# EAGLE schematic PIRT1280A1-12-carrier (EAGLE 9.6.2)

## Sheet 1 of 2: Power Supply
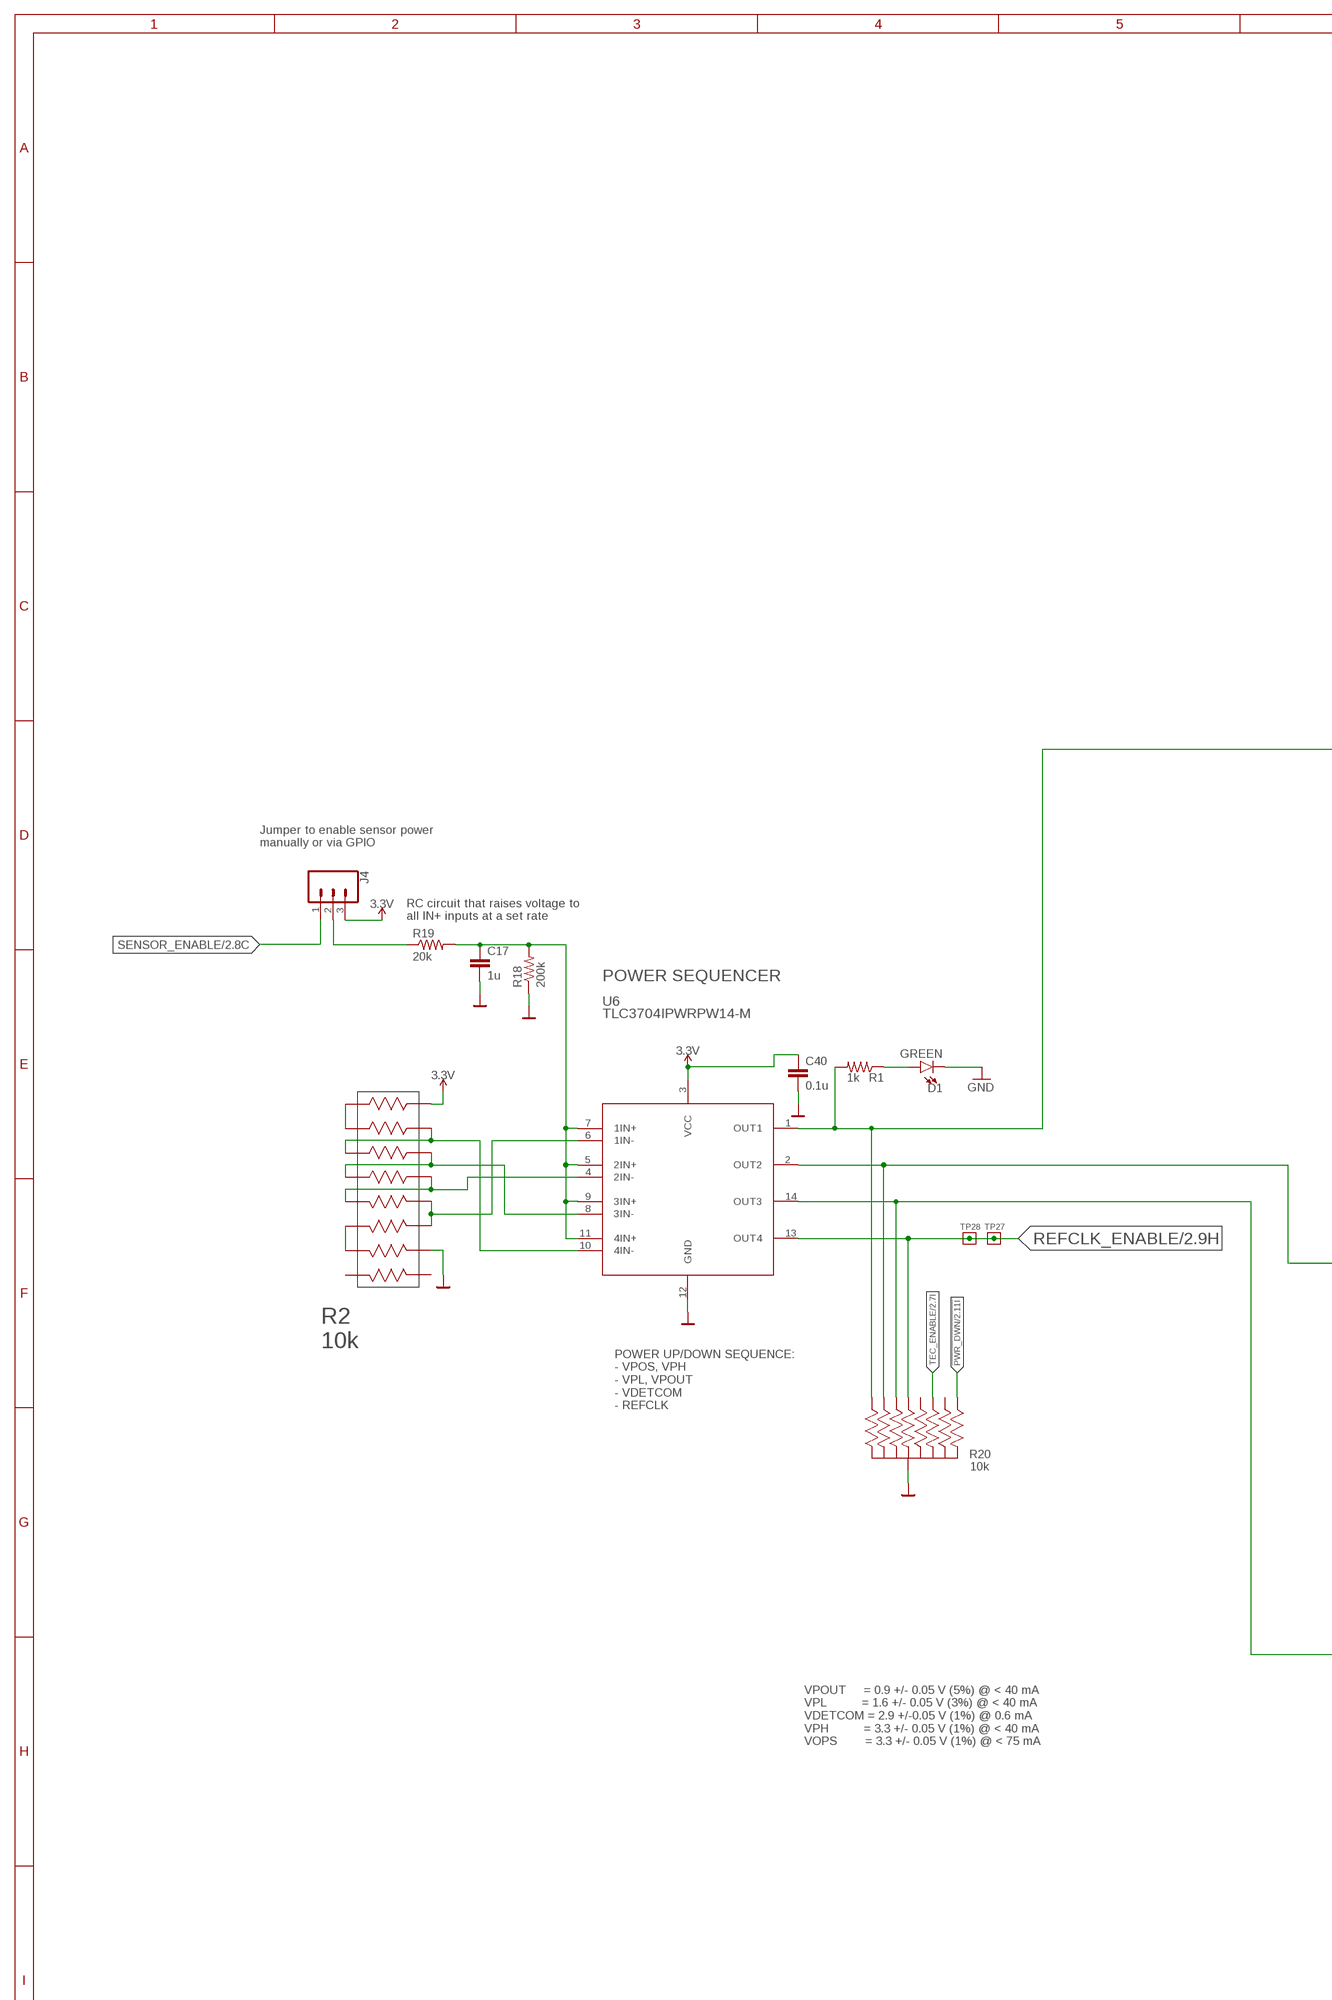
[diagram p0: schematic, sheet 1, part 1 of 2]
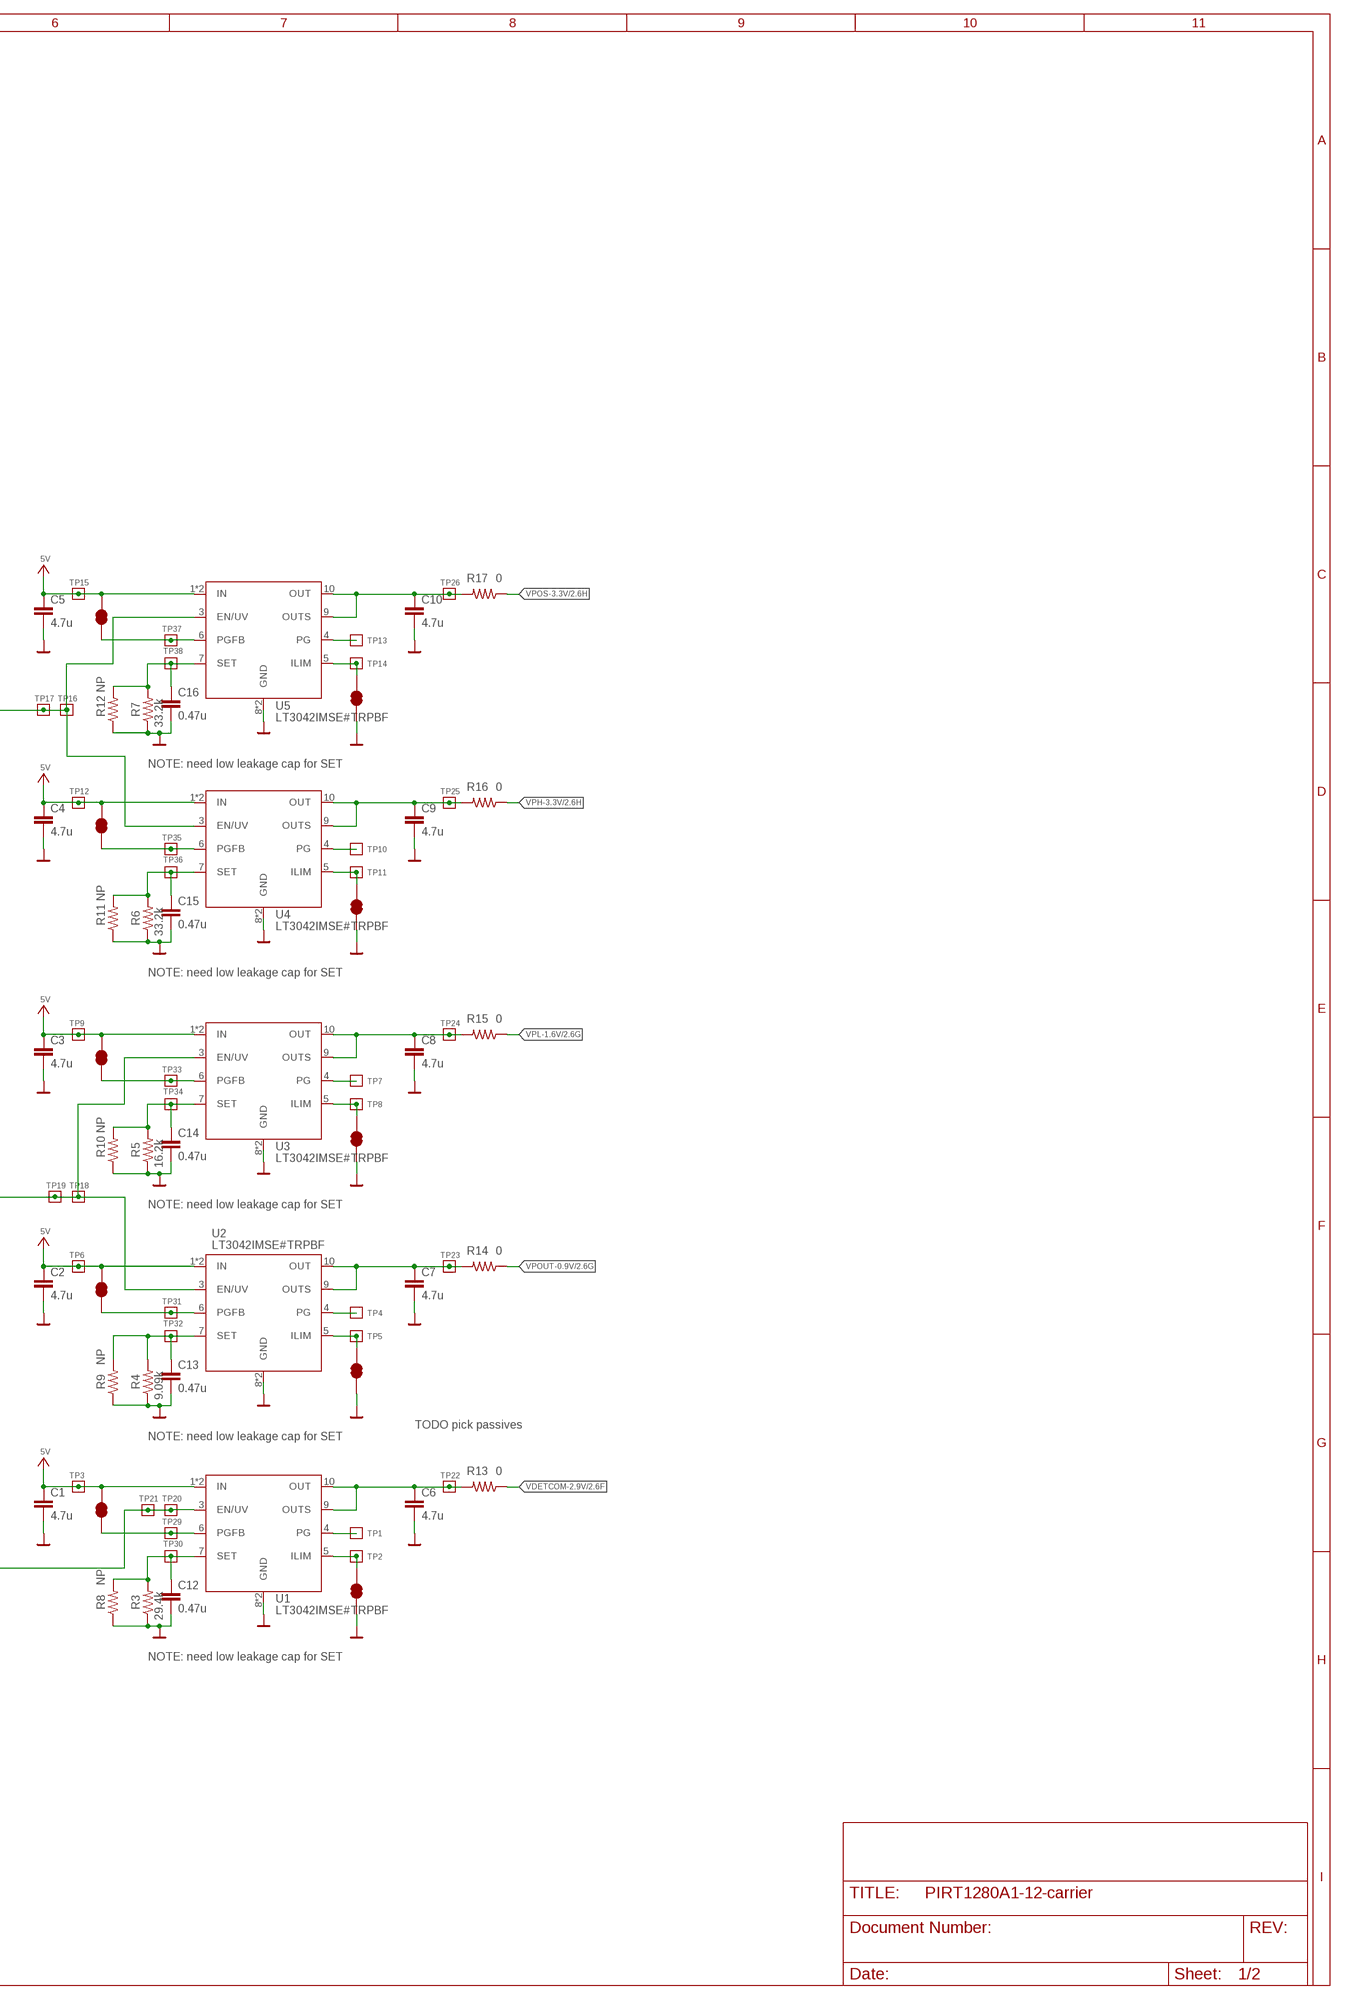
[diagram p1: schematic, sheet 1, part 2 of 2]

### Parts
C1  4.7u  C-EU0603-A  [.0603-A]
C2  4.7u  C-EU0603-A  [.0603-A]
C3  4.7u  C-EU0603-A  [.0603-A]
C4  4.7u  C-EU0603-A  [.0603-A]
C5  4.7u  C-EU0603-A  [.0603-A]
C6  4.7u  C-EU0603-A  [.0603-A]
C7  4.7u  C-EU0603-A  [.0603-A]
C8  4.7u  C-EU0603-A  [.0603-A]
C9  4.7u  C-EU0603-A  [.0603-A]
C10  4.7u  C-EU0603-A  [.0603-A]
C12  0.47u  C-EU0603-A  [.0603-A]
C13  0.47u  C-EU0603-A  [.0603-A]
C14  0.47u  C-EU0603-A  [.0603-A]
C15  0.47u  C-EU0603-A  [.0603-A]
C16  0.47u  C-EU0603-A  [.0603-A]
C17  1u  C-EU0603-A  [.0603-A]
C40  0.1u  C-EU0603-A  [.0603-A]
D1  GREEN  LED-GREEN0603  [LED-0603]
J4  455-1750-1-ND  CONN_03  [1X03]
R1  1k  R-US_0603-A  [.0603-A]
R2  10k  EXB-2HV103JV  [RES_EXB2HV]
R3  29.4k  R-US_0603-A  [.0603-A]
R4  9.09k  R-US_0603-A  [.0603-A]
R5  16.2k  R-US_0603-A  [.0603-A]
R6  33.2k  R-US_0603-A  [.0603-A]
R7  33.2k  R-US_0603-A  [.0603-A]
R8  NP  R-US_0603-A  [.0603-A]
R9  NP  R-US_0603-A  [.0603-A]
R10  NP  R-US_0603-A  [.0603-A]
R11  NP  R-US_0603-A  [.0603-A]
R12  NP  R-US_0603-A  [.0603-A]
R13  0  R-US_0603-A  [.0603-A]
R14  0  R-US_0603-A  [.0603-A]
R15  0  R-US_0603-A  [.0603-A]
R16  0  R-US_0603-A  [.0603-A]
R17  0  R-US_0603-A  [.0603-A]
R18  200k  R-US_0805-A  [.0805-A]
R19  20k  R-US_0805-A  [.0805-A]
R20  10k  EXB-A10P391JC_ARRAY_EXBA-M  [ARRAY_EXBA-M]
SJ1  JUMPER-SMT_2_NC_TRACE_NO-SILK  [SMT-JUMPER_2_NC_TRACE_NO-SILK]
SJ2  JUMPER-SMT_2_NC_TRACE_NO-SILK  [SMT-JUMPER_2_NC_TRACE_NO-SILK]
SJ3  JUMPER-SMT_2_NC_TRACE_NO-SILK  [SMT-JUMPER_2_NC_TRACE_NO-SILK]
SJ4  JUMPER-SMT_2_NC_TRACE_NO-SILK  [SMT-JUMPER_2_NC_TRACE_NO-SILK]
SJ5  JUMPER-SMT_2_NC_TRACE_NO-SILK  [SMT-JUMPER_2_NC_TRACE_NO-SILK]
SJ6  JUMPER-SMT_2_NC_TRACE_NO-SILK  [SMT-JUMPER_2_NC_TRACE_NO-SILK]
SJ7  JUMPER-SMT_2_NC_TRACE_NO-SILK  [SMT-JUMPER_2_NC_TRACE_NO-SILK]
SJ8  JUMPER-SMT_2_NC_TRACE_NO-SILK  [SMT-JUMPER_2_NC_TRACE_NO-SILK]
SJ9  JUMPER-SMT_2_NC_TRACE_NO-SILK  [SMT-JUMPER_2_NC_TRACE_NO-SILK]
SJ10  JUMPER-SMT_2_NC_TRACE_NO-SILK  [SMT-JUMPER_2_NC_TRACE_NO-SILK]
TP1  TEST-POINT-LARGE-SQUARE  [1X01]
TP2  TEST-POINT-LARGE-SQUARE  [1X01]
TP3  TEST-POINT-LARGE-SQUARE  [1X01]
TP4  TEST-POINT-LARGE-SQUARE  [1X01]
TP5  TEST-POINT-LARGE-SQUARE  [1X01]
TP6  TEST-POINT-LARGE-SQUARE  [1X01]
TP7  TEST-POINT-LARGE-SQUARE  [1X01]
TP8  TEST-POINT-LARGE-SQUARE  [1X01]
TP9  TEST-POINT-LARGE-SQUARE  [1X01]
TP10  TEST-POINT-LARGE-SQUARE  [1X01]
TP11  TEST-POINT-LARGE-SQUARE  [1X01]
TP12  TEST-POINT-LARGE-SQUARE  [1X01]
TP13  TEST-POINT-LARGE-SQUARE  [1X01]
TP14  TEST-POINT-LARGE-SQUARE  [1X01]
TP15  TEST-POINT-LARGE-SQUARE  [1X01]
TP16  TEST-POINT-LARGE-SQUARE  [1X01]
TP17  TEST-POINT-LARGE-SQUARE  [1X01]
TP18  TEST-POINT-LARGE-SQUARE  [1X01]
TP19  TEST-POINT-LARGE-SQUARE  [1X01]
TP20  TEST-POINT-LARGE-SQUARE  [1X01]
TP21  TEST-POINT-LARGE-SQUARE  [1X01]
TP22  TEST-POINT-LARGE-SQUARE  [1X01]
TP23  TEST-POINT-LARGE-SQUARE  [1X01]
TP24  TEST-POINT-LARGE-SQUARE  [1X01]
TP25  TEST-POINT-LARGE-SQUARE  [1X01]
TP26  TEST-POINT-LARGE-SQUARE  [1X01]
TP27  TEST-POINT-LARGE-SQUARE  [1X01]
TP28  TEST-POINT-LARGE-SQUARE  [1X01]
TP29  TEST-POINT-LARGE-SQUARE  [1X01]
TP30  TEST-POINT-LARGE-SQUARE  [1X01]
TP31  TEST-POINT-LARGE-SQUARE  [1X01]
TP32  TEST-POINT-LARGE-SQUARE  [1X01]
TP33  TEST-POINT-LARGE-SQUARE  [1X01]
TP34  TEST-POINT-LARGE-SQUARE  [1X01]
TP35  TEST-POINT-LARGE-SQUARE  [1X01]
TP36  TEST-POINT-LARGE-SQUARE  [1X01]
TP37  TEST-POINT-LARGE-SQUARE  [1X01]
TP38  TEST-POINT-LARGE-SQUARE  [1X01]
U1  LT3042IMSE#TRPBF  [SOP50P490X110-11N]
U2  LT3042IMSE#TRPBF  [SOP50P490X110-11N]
U3  LT3042IMSE#TRPBF  [SOP50P490X110-11N]
U4  LT3042IMSE#TRPBF  [SOP50P490X110-11N]
U5  LT3042IMSE#TRPBF  [SOP50P490X110-11N]
U6  TLC3704IPWRPW14-M  [14-TSSOP]

### Nets
3.3V: C40.1 J4.3 R2.16 U6.3(VCC) ; also sheet 2
5V: C1.1 C2.1 C3.1 C4.1 C5.1 SJ6.2 SJ7.2 SJ8.2 SJ9.2 SJ10.2 TP3.1 TP6.1 TP9.1 TP12.1 TP15.1 U1.1(IN) U1.2(IN) U2.1(IN) U2.2(IN) U3.1(IN) U3.2(IN) U4.1(IN) U4.2(IN) U5.1(IN) U5.2(IN) ; also sheet 2
!PWR_DWN: R20.1 ; also sheet 2
GND: C1.2 C2.2 C3.2 C4.2 C5.2 C6.2 C7.2 C8.2 C9.2 C10.2 C12.2 C13.2 C14.2 C15.2 C16.2 C17.2 C40.2 D1.C R2.10 R3.1 R4.1 R5.1 R6.1 R7.1 R8.1 R9.1 R10.1 R11.1 R12.1 R18.1 R20.5 R20.10 SJ1.1 SJ2.1 SJ3.1 SJ4.1 SJ5.1 U1.8(GND) U1.11(GND) U2.8(GND) U2.11(GND) U3.8(GND) U3.11(GND) U4.8(GND) U4.11(GND) U5.8(GND) U5.11(GND) U6.12(GND) ; also sheet 2
N$1: R2.1 R2.2
N$2: R2.3 R2.15 U6.10(4IN-)
N$3: R2.4 R2.14 U6.8(3IN-)
N$4: R2.5 R2.13 U6.4(2IN-)
N$5: C17.1 R18.2 R19.2 U6.5(2IN+) U6.7(1IN+) U6.9(3IN+) U6.11(4IN+)
N$6: R2.6 R2.7
N$10: R20.7 TP20.1 TP21.1 U1.3(EN/UV) U6.14(OUT3)
N$11: SJ7.1 TP31.1 U2.6(PGFB)
N$12: SJ2.2 TP4.1 U2.5(ILIM)
N$15: TP5.1 U2.4(PG)
N$17: J4.2 R19.1
N$20: C13.1 R4.2 R9.2 TP32.1 U2.7(SET)
N$21: SJ1.2 TP1.1 U1.5(ILIM)
N$22: SJ6.1 TP29.1 U1.6(PGFB)
N$23: TP2.1 U1.4(PG)
N$24: C12.1 R3.2 R8.2 TP30.1 U1.7(SET)
N$25: R1.2 R20.6 TP16.1 TP17.1 U4.3(EN/UV) U5.3(EN/UV) U6.1(OUT1)
N$26: SJ5.2 TP13.1 U5.5(ILIM)
N$27: SJ10.1 TP37.1 U5.6(PGFB)
N$28: TP14.1 U5.4(PG)
N$29: C16.1 R7.2 R12.2 TP38.1 U5.7(SET)
N$31: SJ4.2 TP10.1 U4.5(ILIM)
N$32: SJ9.1 TP35.1 U4.6(PGFB)
N$33: TP11.1 U4.4(PG)
N$35: C15.1 R6.2 R11.2 TP36.1 U4.7(SET)
N$36: R20.4 TP18.1 TP19.1 U2.3(EN/UV) U3.3(EN/UV) U6.2(OUT2)
N$37: SJ3.2 TP7.1 U3.5(ILIM)
N$38: SJ8.1 TP33.1 U3.6(PGFB)
N$39: TP8.1 U3.4(PG)
N$40: C14.1 R5.2 R10.2 TP34.1 U3.7(SET)
N$44: R2.11 R2.12 U6.6(1IN-)
N$270: D1.A R1.1
REFCLK_ENABLE: R20.3 TP27.1 TP28.1 U6.13(OUT4) ; also sheet 2
SENSOR_ENABLE: J4.1 ; also sheet 2
TEC_ENABLE: R20.2 ; also sheet 2
VDETCOM: C6.1 R13.2 TP22.1 U1.9(OUTS) U1.10(OUT)
VDETCOM-2.9V: R13.1 ; also sheet 2
VPH: C9.1 R16.2 TP25.1 U4.9(OUTS) U4.10(OUT)
VPH-3.3V: R16.1 ; also sheet 2
VPL: C8.1 R15.2 TP24.1 U3.9(OUTS) U3.10(OUT)
VPL-1.6V: R15.1 ; also sheet 2
VPOS: C10.1 R17.2 TP26.1 U5.9(OUTS) U5.10(OUT)
VPOS-3.3V: R17.1 ; also sheet 2
VPOUT: C7.1 R14.2 TP23.1 U2.9(OUTS) U2.10(OUT)
VPOUT-0.9V: R14.1 ; also sheet 2
Unconnected: R2.8 R2.9 R20.8 R20.9

### Notes on the sheet
- NOTE: need low leakage cap for SET
- Jumper to enable sensor power 
  manually or via GPIO
- RC circuit that raises voltage to 
  all IN+ inputs at a set rate
- POWER SEQUENCER
- NOTE: need low leakage cap for SET
- NOTE: need low leakage cap for SET
- POWER UP/DOWN SEQUENCE:
  - VPOS, VPH
  - VPL, VPOUT
  - VDETCOM
  - REFCLK
- TODO pick passives
- NOTE: need low leakage cap for SET
- NOTE: need low leakage cap for SET
- VPOUT     = 0.9 +/- 0.05 V (5%) @ < 40 mA
  VPL          = 1.6 +/- 0.05 V (3%) @ < 40 mA 
  VDETCOM = 2.9 +/-0.05 V (1%) @ 0.6 mA
  VPH          = 3.3 +/- 0.05 V (1%) @ < 40 mA
  VOPS        = 3.3 +/- 0.05 V (1%) @ < 75 mA

## Sheet 2 of 2: PocketBeagle, Serdes, Connectors
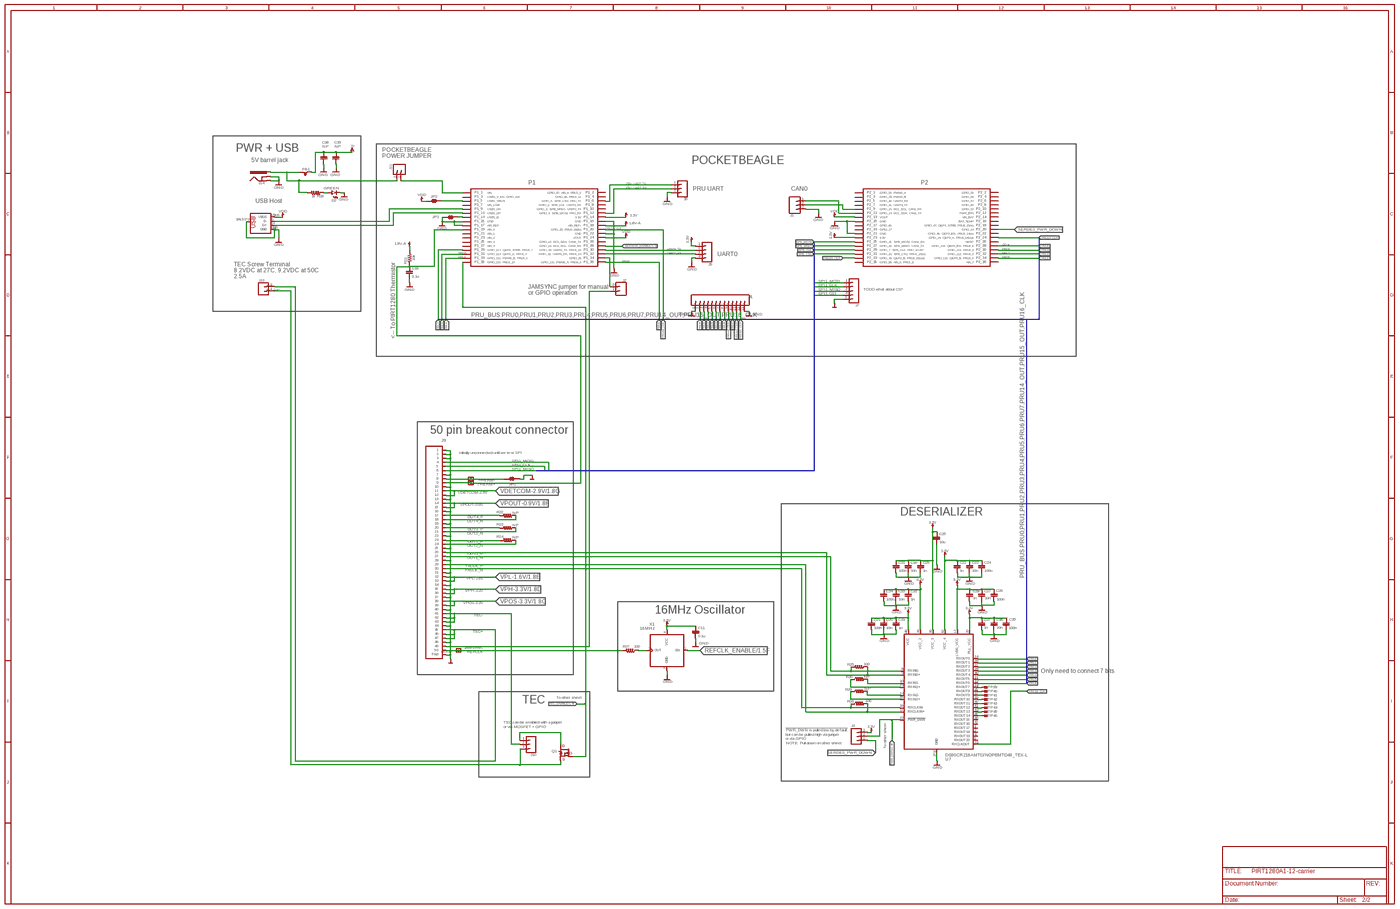
[diagram p2: schematic, sheet 2, overview]
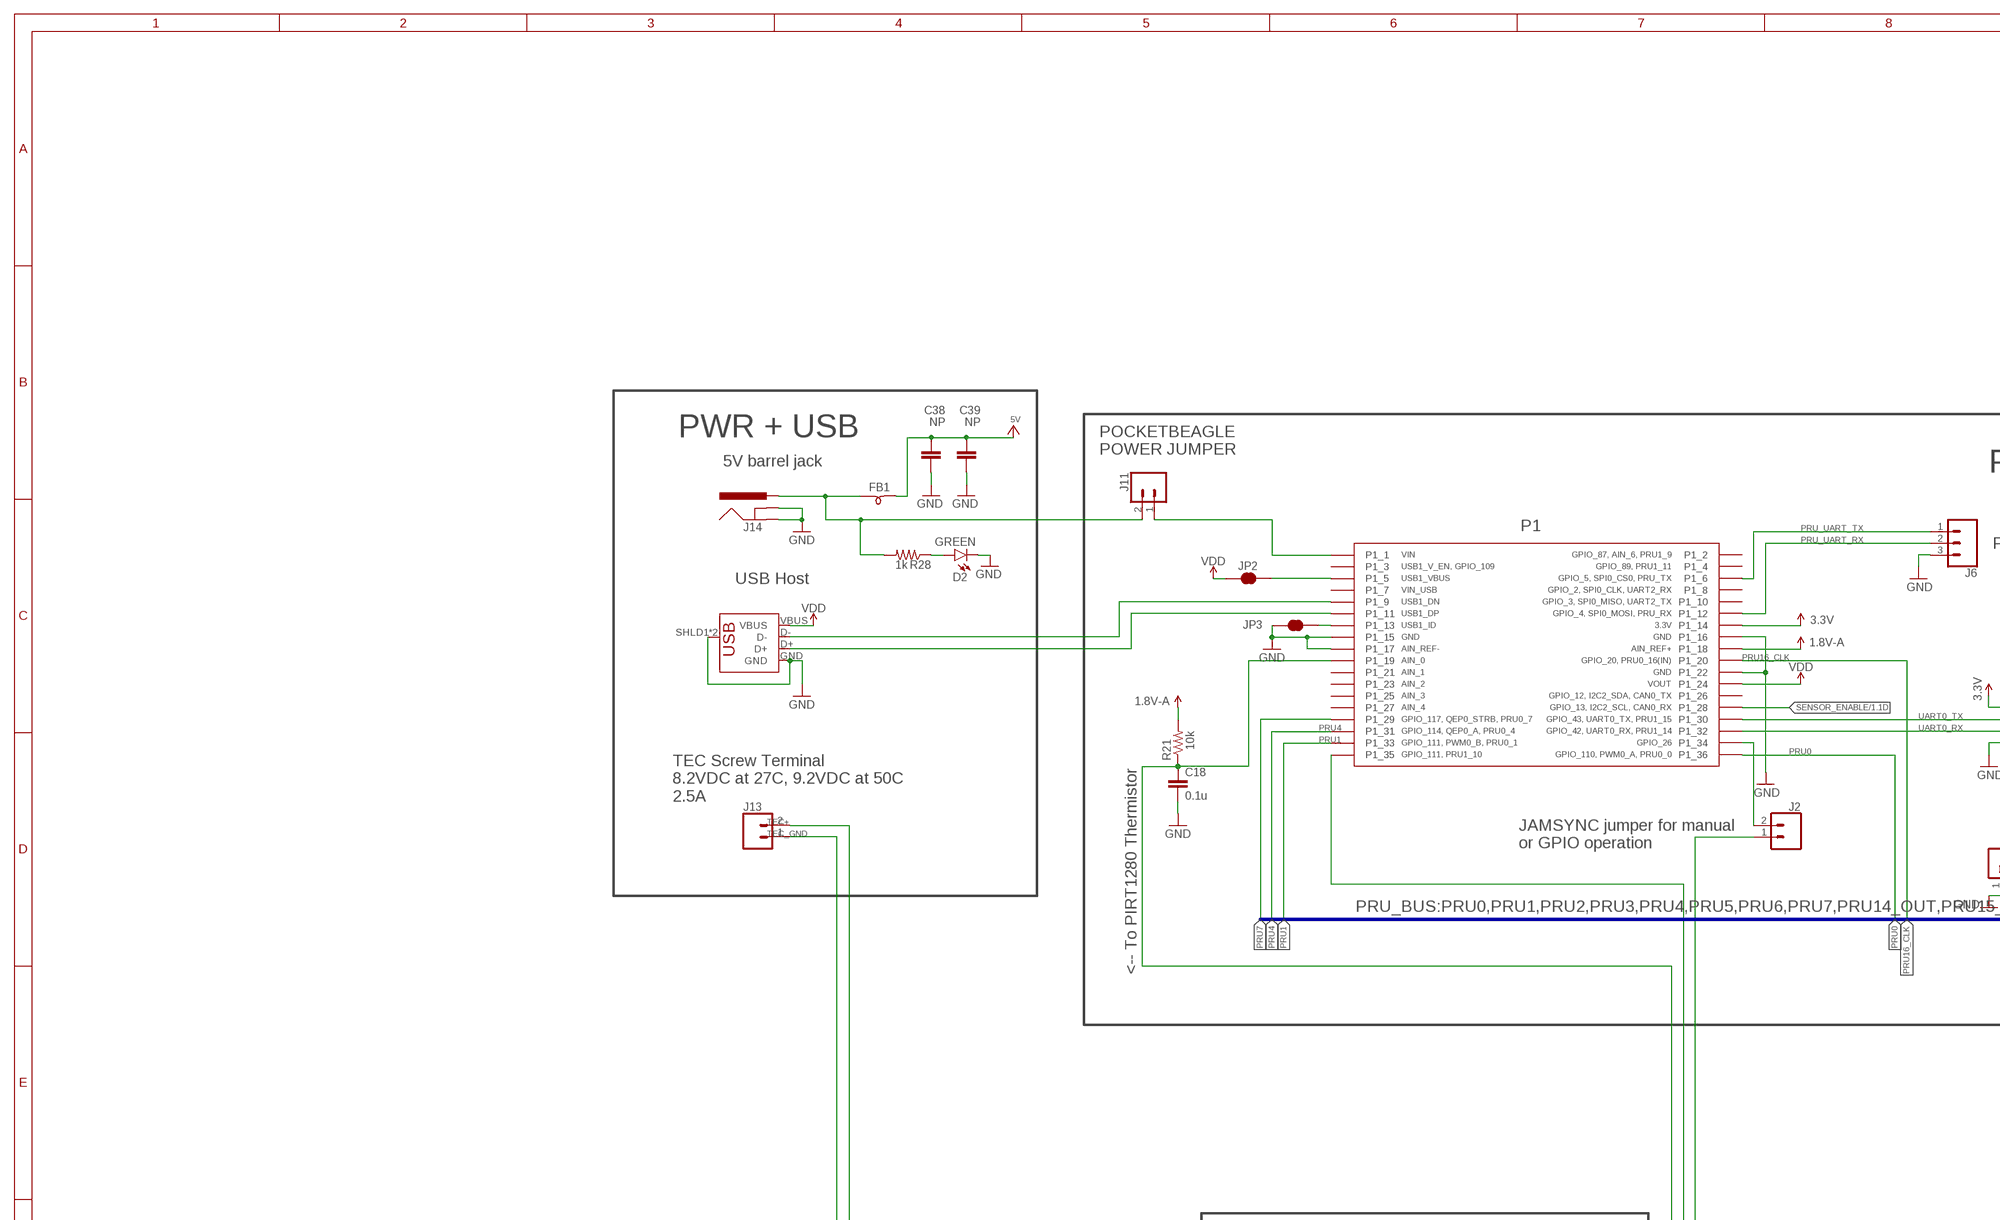
[diagram p3: schematic, sheet 2, part 1 of 4]
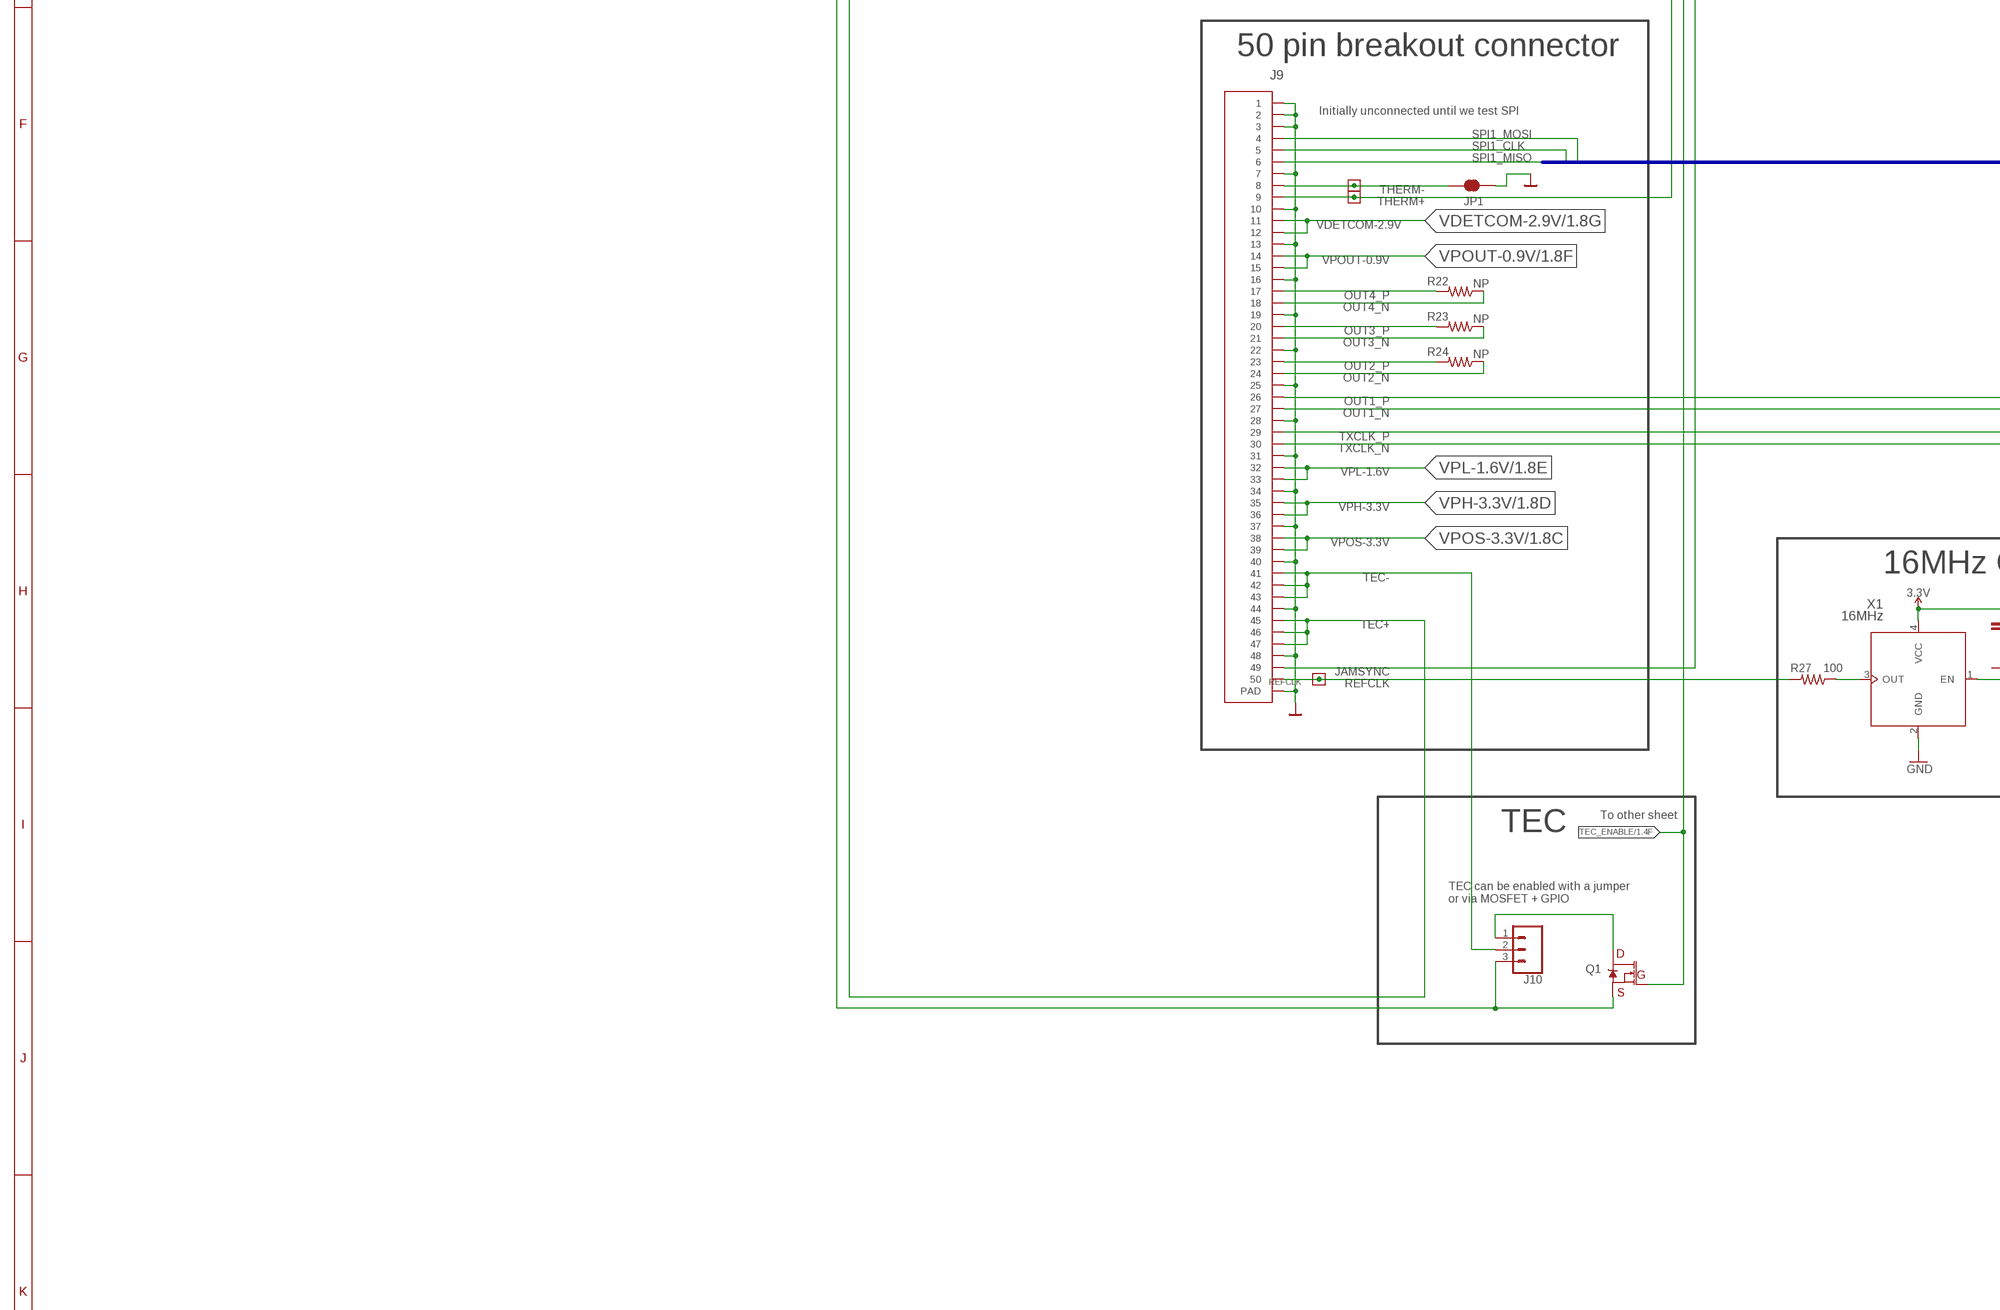
[diagram p4: schematic, sheet 2, part 2 of 4]
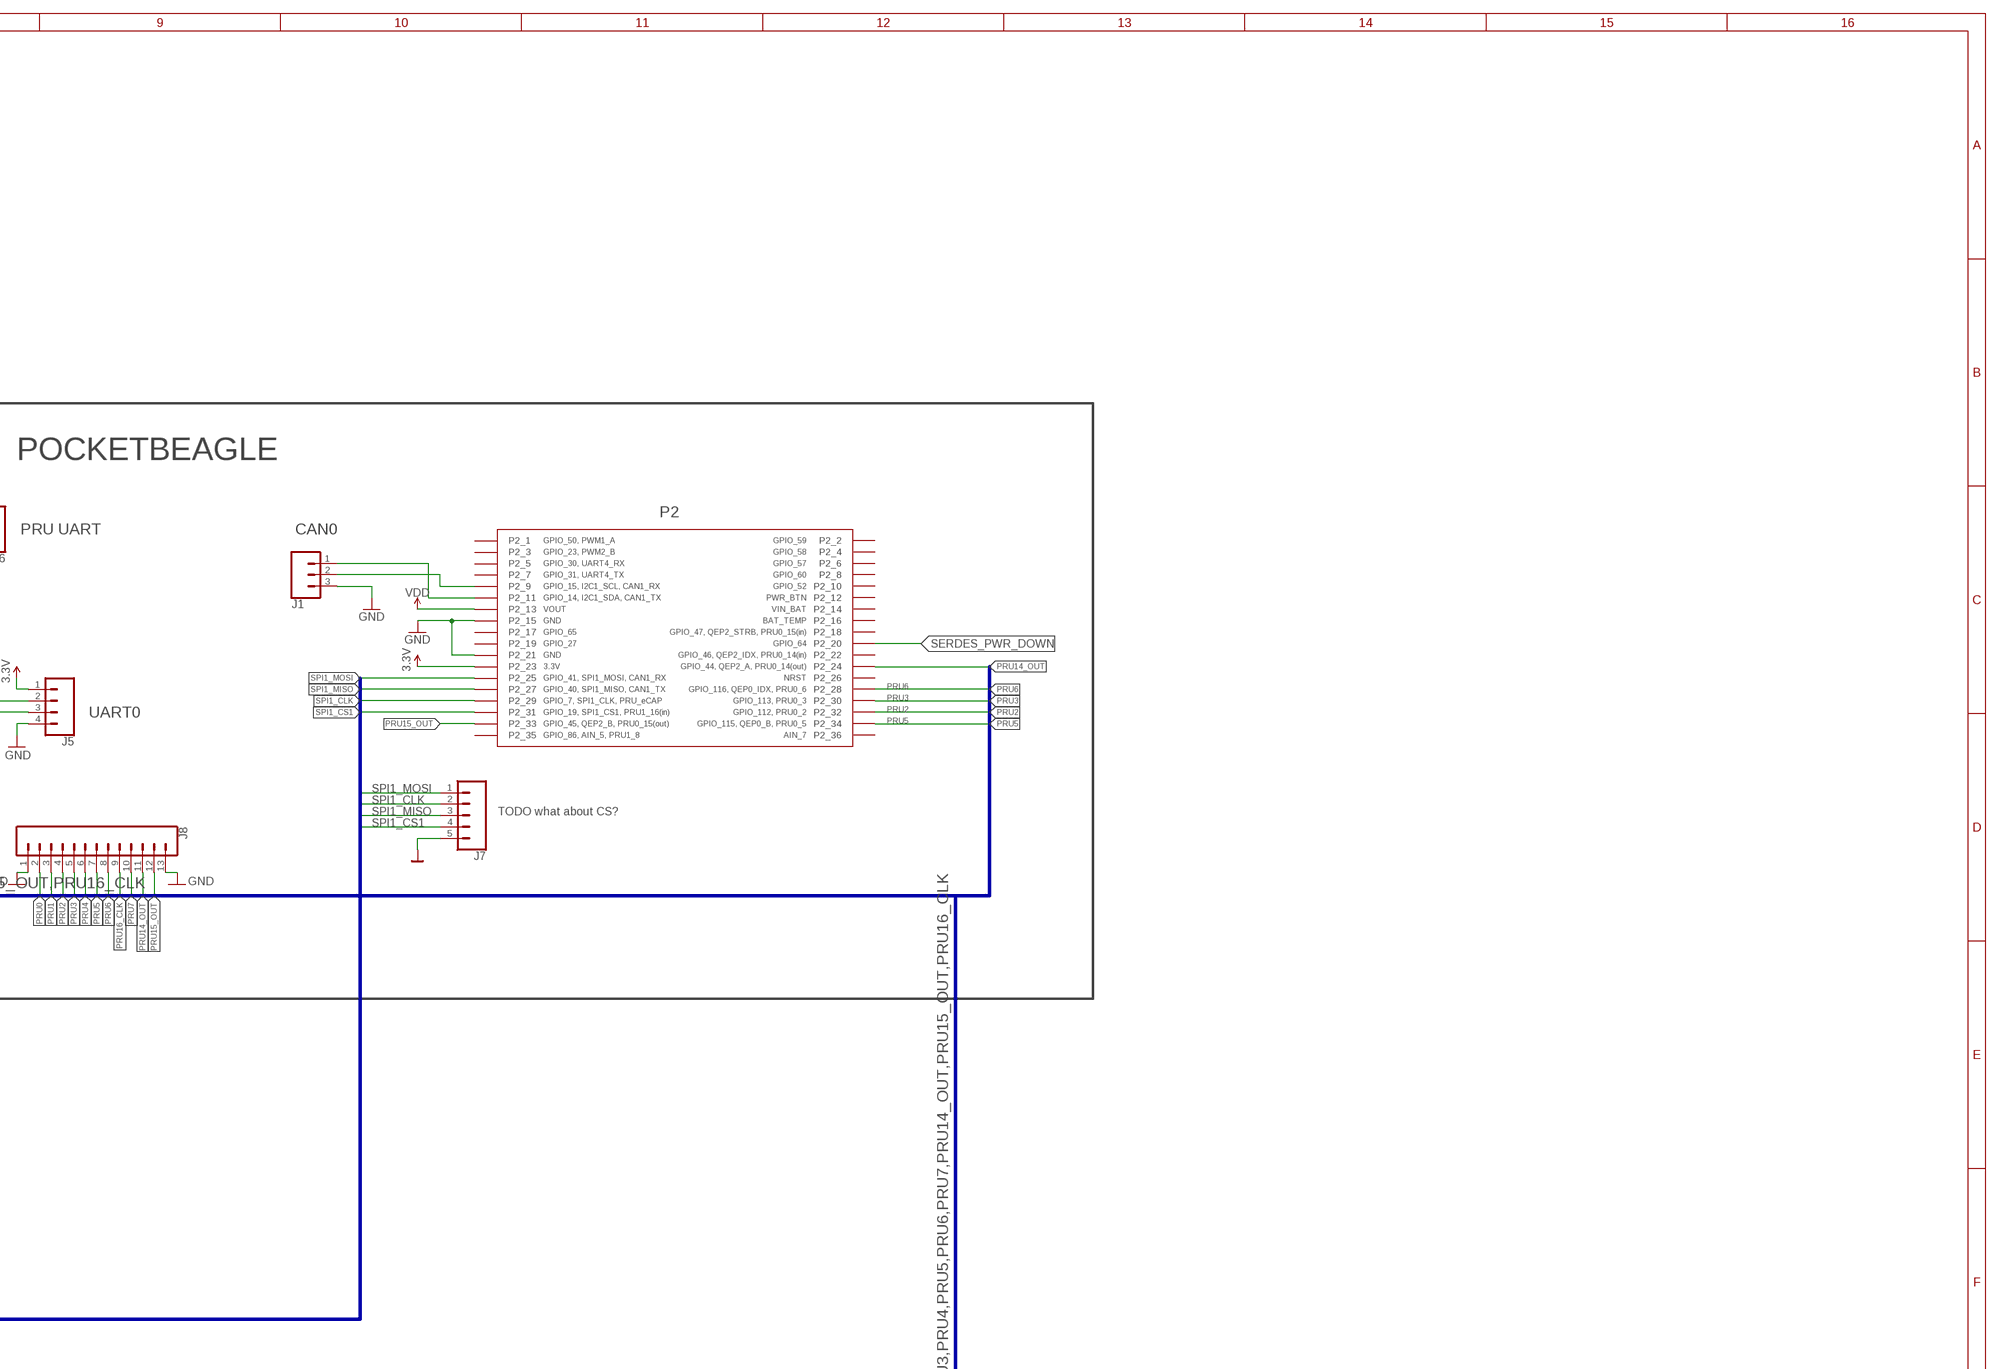
[diagram p5: schematic, sheet 2, part 3 of 4]
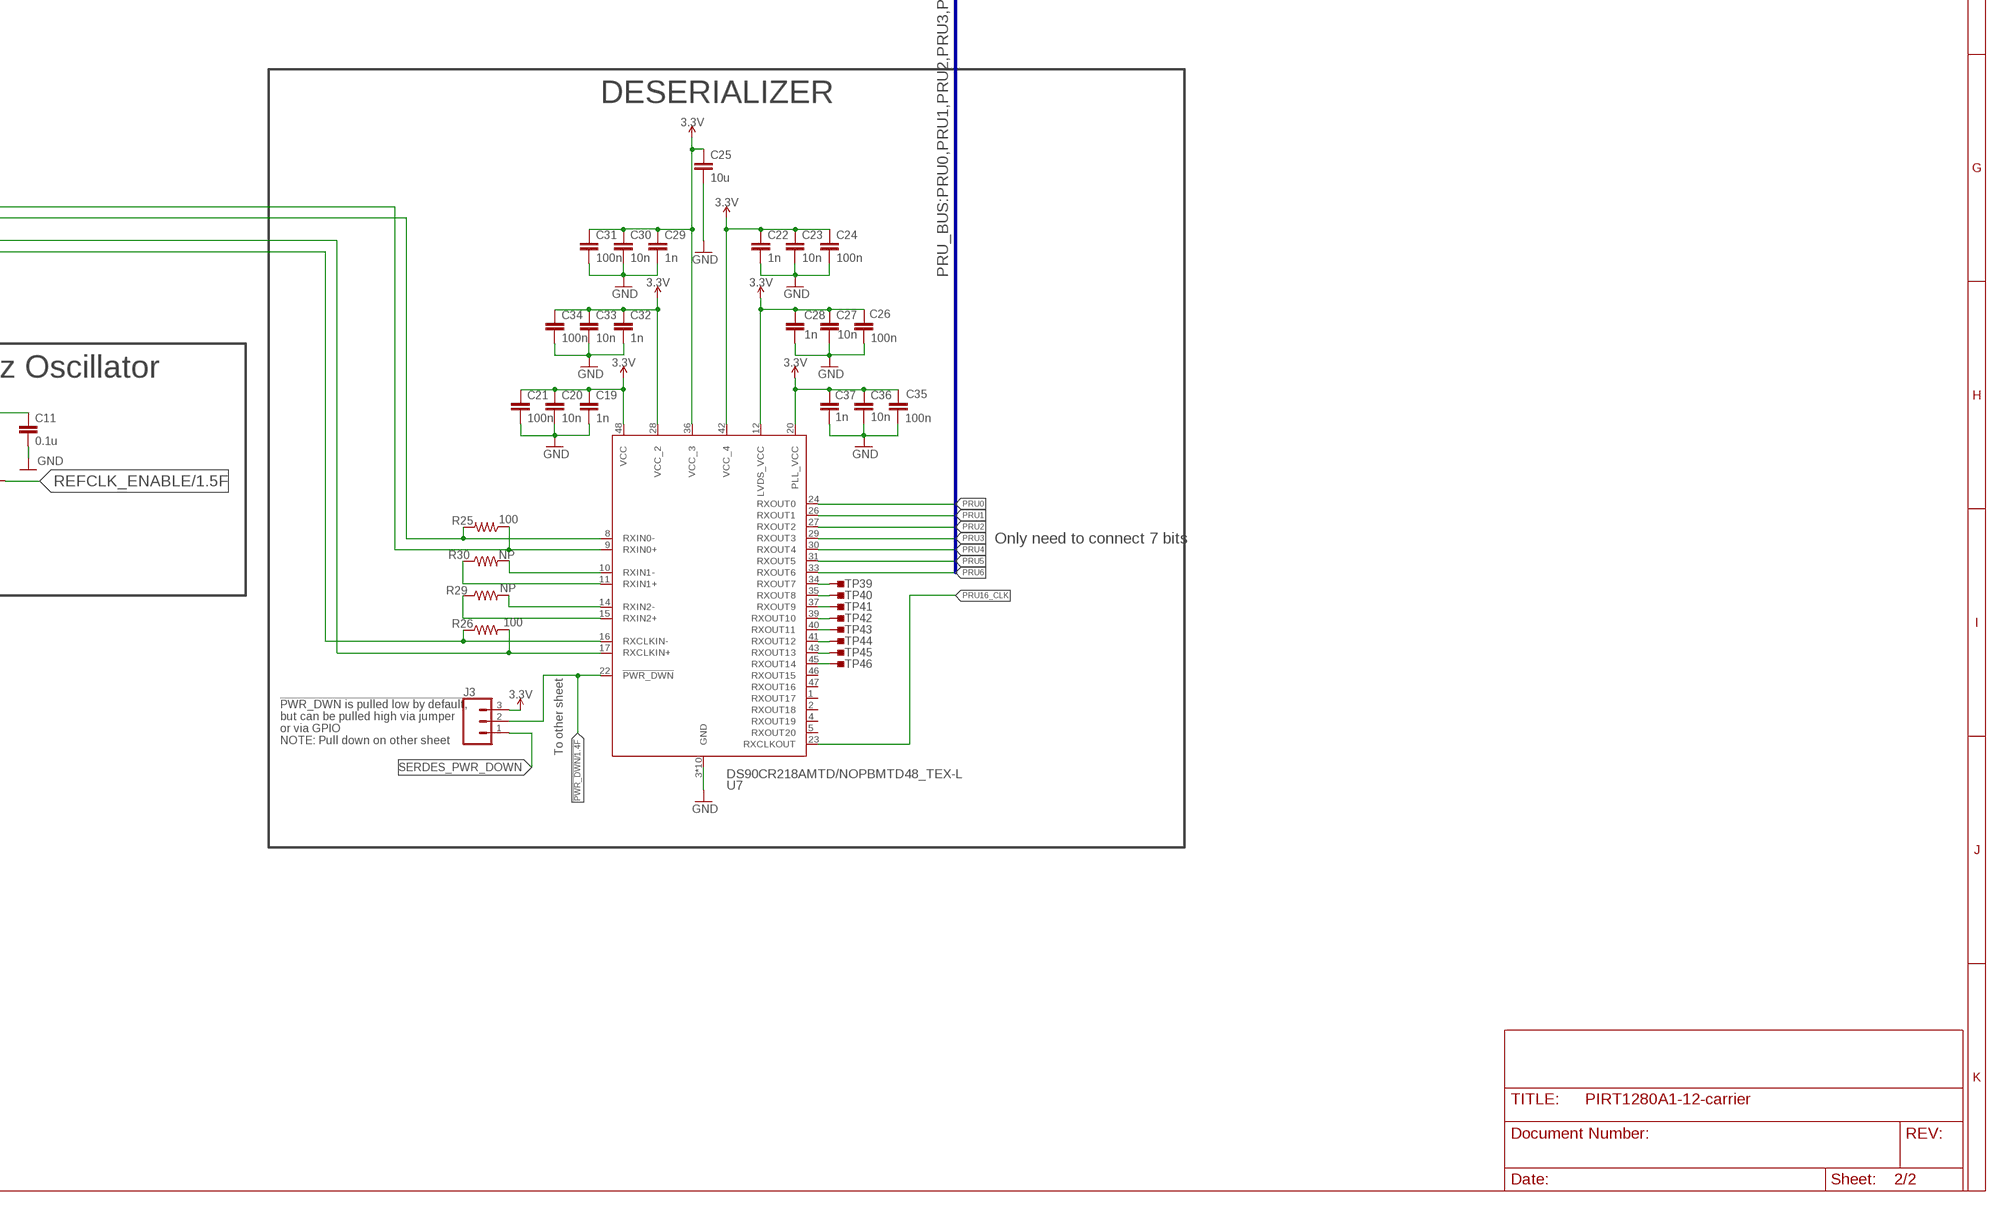
[diagram p6: schematic, sheet 2, part 4 of 4]

### Parts
C11  0.1u  C-EU0603-A  [.0603-A]
C18  0.1u  C-EU0603-A  [.0603-A]
C19  1n  C-EU0402-C-NOSILK  [.0402-C-NOSILK]
C20  10n  C-EU0402-C-NOSILK  [.0402-C-NOSILK]
C21  100n  C-EU0402-C-NOSILK  [.0402-C-NOSILK]
C22  1n  C-EU0402-C-NOSILK  [.0402-C-NOSILK]
C23  10n  C-EU0402-C-NOSILK  [.0402-C-NOSILK]
C24  100n  C-EU0402-C-NOSILK  [.0402-C-NOSILK]
C25  10u  C-EU0603-C-NOSILK  [.0603-C-NOSILK]
C26  100n  C-EU0402-C-NOSILK  [.0402-C-NOSILK]
C27  10n  C-EU0402-C-NOSILK  [.0402-C-NOSILK]
C28  1n  C-EU0402-C-NOSILK  [.0402-C-NOSILK]
C29  1n  C-EU0402-C-NOSILK  [.0402-C-NOSILK]
C30  10n  C-EU0402-C-NOSILK  [.0402-C-NOSILK]
C31  100n  C-EU0402-C-NOSILK  [.0402-C-NOSILK]
C32  1n  C-EU0402-C-NOSILK  [.0402-C-NOSILK]
C33  10n  C-EU0402-C-NOSILK  [.0402-C-NOSILK]
C34  100n  C-EU0402-C-NOSILK  [.0402-C-NOSILK]
C35  100n  C-EU0402-C-NOSILK  [.0402-C-NOSILK]
C36  10n  C-EU0402-C-NOSILK  [.0402-C-NOSILK]
C37  1n  C-EU0402-C-NOSILK  [.0402-C-NOSILK]
C38  NP  C-EUC1210  [C1210]
C39  NP  C-EUC1210  [C1210]
D2  GREEN  LED-GREEN0603  [LED-0603]
FB1  L-BEAD-0805-B  [.0805-B]
J1  455-1750-1-ND  CONN_03  [1X03]
J2  CONN_02  [1X02]
J3  455-1750-1-ND  CONN_03  [1X03]
J5  CONN_04PTH  [1X04]
J6  455-1750-1-ND  CONN_03  [1X03]
J7  CONN_05  [1X05]
J8  CONN_13  [1X13]
J9  5-1734592-0  [TE_5-1734592-0]
J10  455-1750-1-ND  CONN_03  [1X03]
J11  CONN_02  [1X02]
J12  USB_A_SMT_FEMALE  [USB-A-S-SILK-FEMALE]
J13  5MM_SCREW_TERMINAL5MM  [SCREWTERMINAL-5MM-2]
J14  POWER_JACK  [POWER_JACK]
JP1  JUMPER-SMT_2_NC_TRACE_NO-SILK  [SMT-JUMPER_2_NC_TRACE_NO-SILK]
JP2  JUMPER-SMT_2_NC_TRACE_NO-SILK  [SMT-JUMPER_2_NC_TRACE_NO-SILK]
JP3  JUMPER-SMT_2_NC_TRACE_NO-SILK  [SMT-JUMPER_2_NC_TRACE_NO-SILK]
Q1  35A/25V/8.5mΩ  MOSFET-NCH-FDD8780  [DPAK]
R21  10k  R-US_0603-A  [.0603-A]
R22  NP  R-US_0402-C-NOSILK  [.0402-C-NOSILK]
R23  NP  R-US_0402-C-NOSILK  [.0402-C-NOSILK]
R24  NP  R-US_0402-C-NOSILK  [.0402-C-NOSILK]
R25  100  R-US_0402-C-NOSILK  [.0402-C-NOSILK]
R26  100  R-US_0402-C-NOSILK  [.0402-C-NOSILK]
R27  100  R-US_0402-C-NOSILK  [.0402-C-NOSILK]
R28  1k  R-US_0603-A  [.0603-A]
R29  NP  R-US_0402-C-NOSILK  [.0402-C-NOSILK]
R30  NP  R-US_0402-C-NOSILK  [.0402-C-NOSILK]
REFCLK  TEST-POINT-LARGE-SQUARE  [1X01]
THERM+  TEST-POINT-LARGE-SQUARE  [1X01]
THERM-  TEST-POINT-LARGE-SQUARE  [1X01]
TP39  TEST-POINT-SMD-0.5MM  [TESTPOINT_SMD-0.5MM]
TP40  TEST-POINT-SMD-0.5MM  [TESTPOINT_SMD-0.5MM]
TP41  TEST-POINT-SMD-0.5MM  [TESTPOINT_SMD-0.5MM]
TP42  TEST-POINT-SMD-0.5MM  [TESTPOINT_SMD-0.5MM]
TP43  TEST-POINT-SMD-0.5MM  [TESTPOINT_SMD-0.5MM]
TP44  TEST-POINT-SMD-0.5MM  [TESTPOINT_SMD-0.5MM]
TP45  TEST-POINT-SMD-0.5MM  [TESTPOINT_SMD-0.5MM]
TP46  TEST-POINT-SMD-0.5MM  [TESTPOINT_SMD-0.5MM]
U7  DS90CR218AMTD/NOPBMTD48_TEX-L  [MTD48_TEX-L]
U$2  POCKETBEAGLE  [POCKETBEAGLE]
X1  16MHz  OSC_GENERIC_2.5X2.0  [OSC_2.5X2.0]

### Nets
1.8V-A: R21.2 U$2.P1_18
3.3V: C11.1 C19.1 C20.1 C21.1 C22.1 C23.1 C24.1 C25.1 C26.1 C27.1 C28.1 C29.1 C30.1 C31.1 C32.1 C33.1 C34.1 C35.1 C36.1 C37.1 J3.3 J5.1 U7.12(LVDS_VCC) U7.20(PLL_VCC) U7.28(VCC_2) U7.36(VCC_3) U7.42(VCC_4) U7.48(VCC) U$2.P1_14 U$2.P2_23 X1.4(VCC) ; also sheet 1
5V: C38.1 C39.1 FB1.2 ; also sheet 1
!PWR_DWN: J3.2 U7.22(!PWR_DWN) ; also sheet 1
CAN_RX: J1.2 U$2.P2_9
CAN_TX: J1.1 U$2.P2_11
GND: C11.2 C18.2 C19.2 C20.2 C21.2 C22.2 C23.2 C24.2 C25.2 C26.2 C27.2 C28.2 C29.2 C30.2 C31.2 C32.2 C33.2 C34.2 C35.2 C36.2 C37.2 C38.2 C39.2 D2.C J1.3 J5.4 J6.3 J7.5 J8.1 J8.13 J9.1 J9.2 J9.3 J9.7 J9.10 J9.13 J9.16 J9.19 J9.22 J9.25 J9.28 J9.31 J9.34 J9.37 J9.40 J9.44 J9.48 J9.S1(PAD) J9.S2(PAD) J12.GND J12.SHLD1(SHIELD) J12.SHLD2(SHIELD) J14.GND J14.GNDBREAK JP1.1 JP3.2 U7.3(GND) U7.7(GND) U7.13(GND) U7.18(GND) U7.19(GND) U7.21(GND) U7.25(GND) U7.32(GND) U7.38(GND) U7.44(GND) U$2.P1_15 U$2.P1_16 U$2.P1_17 U$2.P1_22 U$2.P2_15 U$2.P2_21 X1.2(GND) ; also sheet 1
JAMSYNC: J2.1 J9.49
N$7: FB1.1 J11.2 J14.PWR R28.2
N$8: JP2.1 U$2.P1_5
N$9: R27.1 X1.3(OUT)
N$13: R29.2 U7.14(RXIN2-)
N$14: R29.1 U7.15(RXIN2+)
N$16: JP3.1 U$2.P1_13
N$18: R30.2 U7.10(RXIN1-)
N$19: R30.1 U7.11(RXIN1+)
N$30: J11.1 U$2.P1_1
N$34: D2.A R28.1
N$47: TP39.TP U7.34(RXOUT7)
N$48: TP40.TP U7.35(RXOUT8)
N$49: TP41.TP U7.37(RXOUT9)
N$50: TP42.TP U7.39(RXOUT10)
N$51: TP43.TP U7.40(RXOUT11)
N$52: TP44.TP U7.41(RXOUT12)
N$53: TP45.TP U7.43(RXOUT13)
N$54: TP46.TP U7.45(RXOUT14)
N$55: J2.2 U$2.P1_34
N$56: J10.1 Q1.4(D)
OUT1_N [diff-pair]: J9.27 R25.2 U7.8(RXIN0-)
OUT1_P [diff-pair]: J9.26 R25.1 U7.9(RXIN0+)
OUT2_N [diff-pair]: J9.24 R24.1
OUT2_P [diff-pair]: J9.23 R24.2
OUT3_N [diff-pair]: J9.21 R23.1
OUT3_P [diff-pair]: J9.20 R23.2
OUT4_N [diff-pair]: J9.18 R22.1
OUT4_P [diff-pair]: J9.17 R22.2
PRU0: J8.2 U7.24(RXOUT0) U$2.P1_36
PRU1: J8.3 U7.26(RXOUT1) U$2.P1_33
PRU2: J8.4 U7.27(RXOUT2) U$2.P2_32
PRU3: J8.5 U7.29(RXOUT3) U$2.P2_30
PRU4: J8.6 U7.30(RXOUT4) U$2.P1_31
PRU5: J8.7 U7.31(RXOUT5) U$2.P2_34
PRU6: J8.8 U7.33(RXOUT6) U$2.P2_28
PRU7: J8.10 U$2.P1_29
PRU14_OUT: J8.11 U$2.P2_24
PRU15_OUT: J8.12 U$2.P2_33
PRU16_CLK: J8.9 U7.23(RXCLKOUT) U$2.P1_20
PRU_UART_RX: J6.2 U$2.P1_12
PRU_UART_TX: J6.1 U$2.P1_6
REFCLK: J9.50 R27.2 REFCLK.1
REFCLK_ENABLE: X1.1(EN) ; also sheet 1
SENSOR_ENABLE: U$2.P1_28 ; also sheet 1
SERDES_PWR_DOWN: J3.1 U$2.P2_20
SPI1_CLK: J7.2 J9.5 U$2.P2_29
SPI1_CS1: J7.4 U$2.P2_31
SPI1_MISO: J7.3 J9.6 U$2.P2_27
SPI1_MOSI: J7.1 J9.4 U$2.P2_25
TEC+: J9.45 J9.46 J9.47 J13.2
TEC-: J9.41 J9.42 J9.43 J10.2
TEC_ENABLE: Q1.1(G) U$2.P1_35 ; also sheet 1
TEC_GND: J10.3 J13.1 Q1.3(S)
THERM+: C18.1 J9.9 R21.1 THERM+.1 U$2.P1_19
THERM-: J9.8 JP1.2 THERM-.1
TXCLK_N [diff-pair]: J9.30 R26.1 U7.16(RXCLKIN-)
TXCLK_P [diff-pair]: J9.29 R26.2 U7.17(RXCLKIN+)
UART0_RX: J5.3 U$2.P1_32
UART0_TX: J5.2 U$2.P1_30
USB_N: J12.D- U$2.P1_9
USB_P: J12.D+ U$2.P1_11
VDD: J12.VBUS JP2.2 U$2.P1_24 U$2.P2_13
VDETCOM-2.9V: J9.11 J9.12 ; also sheet 1
VPH-3.3V: J9.35 J9.36 ; also sheet 1
VPL-1.6V: J9.32 J9.33 ; also sheet 1
VPOS-3.3V: J9.38 J9.39 ; also sheet 1
VPOUT-0.9V: J9.14 J9.15 ; also sheet 1
Unconnected: U7.1(RXOUT17) U7.2(RXOUT18) U7.4(RXOUT19) U7.5(RXOUT20) U7.46(RXOUT15) U7.47(RXOUT16) U$2.P1_2 U$2.P1_3 U$2.P1_4 U$2.P1_7 U$2.P1_8 U$2.P1_10 U$2.P1_21 U$2.P1_23 U$2.P1_25 U$2.P1_26 U$2.P1_27 U$2.P2_1 U$2.P2_2 U$2.P2_3 U$2.P2_4 U$2.P2_5 U$2.P2_6 U$2.P2_7 U$2.P2_8 U$2.P2_10 U$2.P2_12 U$2.P2_14 U$2.P2_16 U$2.P2_17 U$2.P2_18 U$2.P2_19 U$2.P2_22 U$2.P2_26 U$2.P2_35 U$2.P2_36

### Buses
SPI1_CLK,SPI1_CS1,SPI1_MISO,SPI1_MOSI
PRU_BUS:PRU0,PRU1,PRU2,PRU3,PRU4,PRU5,PRU6,PRU7,PRU14_OUT,PRU15_OUT,PRU16_CLK

### Notes on the sheet
- PWR + USB
- POCKETBEAGLE 
  POWER JUMPER
- 5V barrel jack
- POCKETBEAGLE
- PRU UART | CAN0
- USB Host
- UART0
- TEC Screw Terminal
  8.2VDC at 27C, 9.2VDC at 50C
  2.5A
- TODO what about CS?
- JAMSYNC jumper for manual 
  or GPIO operation
- <-- To PIRT1280 Thermistor
- 50 pin breakout connector
- Initially unconnected until we test SPI
- DESERIALIZER
- 16MHz Oscillator
- Only need to connect 7 bits
- To other sheet
- TEC
- TEC can be enabled with a jumper 
  or via MOSFET + GPIO
- !PWR_DWN is pulled low by default, 
  but can be pulled high via jumper
  or via GPIO
  NOTE: Pull down on other sheet
- To other sheet

## Library data of the parts
C1-C18 C38-C40 = oresat-rcl:C-EU: CAPACITOR, European symbol
C19 C22 C28 C29 C32 C37 = oresat-rcl:C-EU: CAPACITOR, European symbol; DIS: Digi-Key; DPN: 490-6350-1-ND; MFR: Murata; MPN: GRM155R71H102KA01J
C20 C23 C27 C30 C33 C36 = oresat-rcl:C-EU: CAPACITOR, European symbol; DIS: Digi-Key; DPN: 399-7842-1-ND; MFR: Kemet; MPN: C0603C103M5RACTU
C21 C24 C26 C31 C34 C35 = oresat-rcl:C-EU: CAPACITOR, European symbol; DIS: Digi-Key; DPN: 399-1177-1-ND; MFR: Kemet; MPN: C0805C104Z5VACTU
C25 = oresat-rcl:C-EU: CAPACITOR, European symbol; DIS: Digi-Key; DPN: 490-14372-1-ND; MFR: Murata; MPN: GRM188R61A106KE69J
D1 D2 = SparkFun-LED:LED-GREEN: Green SMD LED Used in manufacturing of various products at SparkFun Packages: 0603 - SMD 0603 package [Product Link] <http://www.futureelectronics.com/en/technologies/semiconductors/optoelectronics/leds/Pages/9894312-LTST-C190GKT.aspx?CrossPart=HSMG-C190&IM=0> LilyPad 1206 - SMD1206 LilyPad package [Product Link] <http://www.futureelectronics.com/en/Technologies/Product.aspx?ProductID=IN150NGHARVATEKCORPORATION2049943&IM=0> 1206 - SMD1206 package [Product Link] <http://www.futureelectronics.com/en/technologies/semiconductors/optoelectronics/leds/Pages/8315665-LTST-C150KGKT.aspx?IM=0> 1206 Bottom Mount -SMD 1206 Bottom Mount [Product Link] <http://www.digikey.com/product-detail/en/lite-on-inc/LTST-C230KGKT/160-1456-1-ND/386854> SparkFun Products: Pro Mini 328 -5V <https://www.sparkfun.com/products/821> RedBoard <https://www.sparkfun.com/products/12757> MP3 Trigger <https://www.sparkfun.com/products/13720> Makey Makey <https://www.sparkfun.com/products/11076>; DESCRIPTION: Green 573nm LED Indication - Discrete 2V 0603 (1608 Metric); DIGI-KEY_PART_NUMBER: 732-12017-1-ND; MANUFACTURER: Würth Elektronik; MANUFACTURER_PART_NUMBER: 150060VS55040
FB1 = oresat-rcl:L-BEAD-*: Bead or Chip inductor ("ferrite bead") for EMI suppression
J1 J3 J4 J6 J10 = SparkFun-Connectors:CONN_03: Multi connection point. Often used as Generic Header-pin footprint for 0.1 inch spaced/style header connections On any of the 0.1 inch spaced packages, you can populate with these: Break Away Headers - Straight <https://www.sparkfun.com/products/116> (PRT-00116) Break Away Male Headers - Right Angle <https://www.sparkfun.com/products/553> (PRT-00553) Female Headers <https://www.sparkfun.com/products/115> (PRT-00115) Break Away Headers - Machine Pin <https://www.sparkfun.com/products/117> (PRT-00117) Break Away Female Headers - Swiss Machine Pin <https://www.sparkfun.com/products/743> (PRT-00743) Stackable Header - 3 Pin (Female, 0.1") <https://www.sparkfun.com/products/13875> (PRT-13875) For SCREWTERMINALS and SPRING TERMINALS visit here: Screw Terimnals on SparkFun.com <https://www.sparkfun.com/search/results?term=Screw+Terminals> (5mm/3.5mm/2.54mm spacing) This device is also useful as a general connection point to wire up your design to another part of your project. Our various solder wires solder well into these plated through hole pads. Hook-Up Wire - Assortment (Stranded, 22 AWG) <https://www.sparkfun.com/products/11375> (PRT-11375) Hook-Up Wire - Assortment (Solid Core, 22 AWG) <https://www.sparkfun.com/products/11367> (PRT-11367) View the entire wire category on our website here <https://www.sparkfun.com/categories/141> Special notes: Molex polarized connector foot print use with SKU : PRT-08232 with associated crimp pins and housings.; PROD_ID: XXX-00000
J2 J11 = SparkFun-Connectors:CONN_02: Multi connection point. Often used as Generic Header-pin footprint for 0.1 inch spaced/style header connections On any of the 0.1 inch spaced packages, you can populate with these: Break Away Headers - Straight <https://www.sparkfun.com/products/116> (PRT-00116) Break Away Male Headers - Right Angle <https://www.sparkfun.com/products/553> (PRT-00553) Female Headers <https://www.sparkfun.com/products/115> (PRT-00115) Break Away Headers - Machine Pin <https://www.sparkfun.com/products/117> (PRT-00117) Break Away Female Headers - Swiss Machine Pin <https://www.sparkfun.com/products/743> (PRT-00743) For SCREWTERMINALS and SPRING TERMINALS visit here: Screw Terimnals on SparkFun.com <https://www.sparkfun.com/search/results?term=Screw+Terminals> (5mm/3.5mm/2.54mm spacing) This device is also useful as a general connection point to wire up your design to another part of your project. Our various solder wires solder well into these plated through hole pads. Hook-Up Wire - Assortment (Stranded, 22 AWG) <https://www.sparkfun.com/products/11375> (PRT-11375) Hook-Up Wire - Assortment (Solid Core, 22 AWG) <https://www.sparkfun.com/products/11367> (PRT-11367) View the entire wire category on our website here <https://www.sparkfun.com/categories/141> Special notes: Molex polarized connector foot print use with: PRT-08233 with associated crimp pins and housings. 2.54_SCREWTERM for use with PRT-10571. 3.5mm Screw Terminal footprints for PRT-08084 5mm Screw Terminal footprints for use with PRT-08432
J5 = SparkFun-Connectors:CONN_04: Multi connection point. Often used as Generic Header-pin footprint for 0.1 inch spaced/style header connections On any of the 0.1 inch spaced packages, you can populate with these: Break Away Headers - Straight <https://www.sparkfun.com/products/116> (PRT-00116) Break Away Male Headers - Right Angle <https://www.sparkfun.com/products/553> (PRT-00553) Female Headers <https://www.sparkfun.com/products/115> (PRT-00115) Break Away Headers - Machine Pin <https://www.sparkfun.com/products/117> (PRT-00117) Break Away Female Headers - Swiss Machine Pin <https://www.sparkfun.com/products/743> (PRT-00743) For SCREWTERMINALS and SPRING TERMINALS visit here: Screw Terimnals on SparkFun.com <https://www.sparkfun.com/search/results?term=Screw+Terminals> (5mm/3.5mm/2.54mm spacing) This device is also useful as a general connection point to wire up your design to another part of your project. Our various solder wires solder well into these plated through hole pads. Hook-Up Wire - Assortment (Stranded, 22 AWG) <https://www.sparkfun.com/products/11375> (PRT-11375) Hook-Up Wire - Assortment (Solid Core, 22 AWG) <https://www.sparkfun.com/products/11367> (PRT-11367) View the entire wire category on our website here <https://www.sparkfun.com/categories/141> Special notes: Molex polarized connector foot print use with SKU : PRT-08231 with associated crimp pins and housings. 1MM SMD Version SKU: PRT-10208; PROD_ID: CONN-09696
J7 = SparkFun-Connectors:CONN_05: Multi connection point. Often used as Generic Header-pin footprint for 0.1 inch spaced/style header connections On any of the 0.1 inch spaced packages, you can populate with these: Break Away Headers - Straight <https://www.sparkfun.com/products/116> (PRT-00116) Break Away Male Headers - Right Angle <https://www.sparkfun.com/products/553> (PRT-00553) Female Headers <https://www.sparkfun.com/products/115> (PRT-00115) Break Away Headers - Machine Pin <https://www.sparkfun.com/products/117> (PRT-00117) Break Away Female Headers - Swiss Machine Pin <https://www.sparkfun.com/products/743> (PRT-00743) For SCREWTERMINALS and SPRING TERMINALS visit here: Screw Terimnals on SparkFun.com <https://www.sparkfun.com/search/results?term=Screw+Terminals> (5mm/3.5mm/2.54mm spacing) This device is also useful as a general connection point to wire up your design to another part of your project. Our various solder wires solder well into these plated through hole pads. Hook-Up Wire - Assortment (Stranded, 22 AWG) <https://www.sparkfun.com/products/11375> (PRT-11375) Hook-Up Wire - Assortment (Solid Core, 22 AWG) <https://www.sparkfun.com/products/11367> (PRT-11367) View the entire wire category on our website here <https://www.sparkfun.com/categories/141> Special notes: Molex polarized connector foot print use with SKU : PRT-08231 with associated crimp pins and housings. 1MM SMD Version SKU: PRT-10208
J8 = SparkFun-Connectors:CONN_13: Multi connection point. Often used as Generic Header-pin footprint for 0.1 inch spaced/style header connections On any of the 0.1 inch spaced packages, you can populate with these: Break Away Headers - Straight <https://www.sparkfun.com/products/116> (PRT-00116) Break Away Male Headers - Right Angle <https://www.sparkfun.com/products/553> (PRT-00553) Female Headers <https://www.sparkfun.com/products/115> (PRT-00115) Break Away Headers - Machine Pin <https://www.sparkfun.com/products/117> (PRT-00117) Break Away Female Headers - Swiss Machine Pin <https://www.sparkfun.com/products/743> (PRT-00743) For SCREWTERMINALS and SPRING TERMINALS visit here: Screw Terimnals on SparkFun.com <https://www.sparkfun.com/search/results?term=Screw+Terminals> (5mm/3.5mm/2.54mm spacing) This device is also useful as a general connection point to wire up your design to another part of your project. Our various solder wires solder well into these plated through hole pads. Hook-Up Wire - Assortment (Stranded, 22 AWG) <https://www.sparkfun.com/products/11375> (PRT-11375) Hook-Up Wire - Assortment (Solid Core, 22 AWG) <https://www.sparkfun.com/products/11367> (PRT-11367) View the entire wire category on our website here <https://www.sparkfun.com/categories/141> Special notes: Molex polarized connector foot print use with SKU : PRT-08231 with associated crimp pins and housings. 1MM SMD Version SKU: PRT-10208 NOTES ON THE VARIANTS LOCK and LOCK_LONGPADS... This footprint was designed to help hold the alignment of a through-hole component (i.e. 6-pin header) while soldering it into place. You may notice that each hole has been shifted either up or down by 0.005 of an inch from it's more standard position (which is a perfectly straight line). This slight alteration caused the pins (the squares in the middle) to touch the edges of the holes. Because they are alternating, it causes a "brace" to hold the component in place. 0.005 has proven to be the perfect amount of "off-center" position when using our standard breakaway headers. Although looks a little odd when you look at the bare footprint, once you have a header in there, the alteration is very hard to notice. Also,if you push a header all the way into place, it is covered up entirely on the bottom side.
J9 = J-TEConnectivity-X-1734592-X:5-1734592-0; DPN: A100227CT-ND; MPN: 5-1734592-0
J12 = J-Generic-USB_A_Female:USB_A: USB-A Connector Male and female variants, as well as PTH and SMT variants SparkFun Products: SparkFun XBee Explorer Dongle <https://www.sparkfun.com/products/11697> PTH Male SparkFun MicroView-USB Programmer <https://www.sparkfun.com/products/12924> SMT Male SparkFun USB Type A Female Breakout <https://www.sparkfun.com/products/12700> SMT Female; DESCRIPTION: SparkFun Accessories USB Female Type A SMD Connector; DPN: A115151-ND; MANUFACTURER: SparkFun; MANUFACTURER_PART_NUMBER: PRT-09011; MOUSER_PART_NUMBER: 474-PRT-09011; POSSIBLE_DPNS: A115151-ND
J13 = J-Generic-5mm-Screw-Terminal:5MM_SCREW_TERMINAL: Multi connection point. Often used as Generic Header-pin footprint for 0.1 inch spaced/style header connections On any of the 0.1 inch spaced packages, you can populate with these: Break Away Headers - Straight <https://www.sparkfun.com/products/116> (PRT-00116) Break Away Male Headers - Right Angle <https://www.sparkfun.com/products/553> (PRT-00553) Female Headers <https://www.sparkfun.com/products/115> (PRT-00115) Break Away Headers - Machine Pin <https://www.sparkfun.com/products/117> (PRT-00117) Break Away Female Headers - Swiss Machine Pin <https://www.sparkfun.com/products/743> (PRT-00743) For SCREWTERMINALS and SPRING TERMINALS visit here: Screw Terimnals on SparkFun.com <https://www.sparkfun.com/search/results?term=Screw+Terminals> (5mm/3.5mm/2.54mm spacing) This device is also useful as a general connection point to wire up your design to another part of your project. Our various solder wires solder well into these plated through hole pads. Hook-Up Wire - Assortment (Stranded, 22 AWG) <https://www.sparkfun.com/products/11375> (PRT-11375) Hook-Up Wire - Assortment (Solid Core, 22 AWG) <https://www.sparkfun.com/products/11367> (PRT-11367) View the entire wire category on our website here <https://www.sparkfun.com/categories/141> Special notes: Molex polarized connector foot print use with: PRT-08233 with associated crimp pins and housings. 2.54_SCREWTERM for use with PRT-10571. 3.5mm Screw Terminal footprints for PRT-08084 5mm Screw Terminal footprints for use with PRT-08432; DPN: WM12755-ND; MPN: 0395430002; POSSIBLE_DPNS: WM12755-ND
J14 = J-Generic-5.5mm-Barrel-Jack:POWER_JACK: Power Jack Connector This is the standard 5.5mm barrel jack for power. The PTH is the most common, proven, reliable, footprint. The Slot footprint only works if the mill layer is transmitted to the PCB fab house so be warned. Here are the connectors we sell at SparkFun: DC Barrel Power Jack/Connector <https://www.sparkfun.com/products/119> (PRT-00119) DC Barrel Power Jack/Connector (SMD) <https://www.sparkfun.com/products/12748> (PRT-12748) DC Barrel Jack Adapter - Breadboard Compatible <https://www.sparkfun.com/products/10811> (PRT-10811) It is used on this SparkFun product (and many, many others): SparkFun RedBoard - Programmed with Arduino <https://www.sparkfun.com/products/12757> (DEV-12757) Also, if you need a mating power supply or connector, please check these out: Wall Adapter Power Supply - 9VDC 650mA <https://www.sparkfun.com/products/298> (TOL-00298) DC Barrel Jack Adapter - Male <https://www.sparkfun.com/products/10287> (PRT-10287); DPN: CP-202A-ND; MPN: PJ-202A
JP1-JP3 SJ1-SJ10 = SparkFun-Jumpers:JUMPER-SMT_2_NC_TRACE: Normally closed trace jumper This jumper has a trace between two pads so it's normally closed (NC). Use a razor knife to open the connection. For best results follow the IPC guidelines for cutting traces: Cutout at least 0.063 mm (0.005 in). Remove all loose material to clean up the cut area. Seal the cut with an approved epoxy. Reapply solder to reclose the connection.
Q1 = Q-Fairchild-FDD8780-MOSFET-NCH:MOSFET-NCH: N-channel MOSFETs Voltage controlled devices that allow control of high current outputs. SparkFun Products: SparkFun OpenScale <https://www.sparkfun.com/products/13261> SparkFun Digital Sandbox <https://www.sparkfun.com/products/12651> SparkFun Monster Moto Shield <https://www.sparkfun.com/products/10182> SparkFun MOSFET Power Controller <https://www.sparkfun.com/products/11214>; DPN: FDD8780CT-ND; MPN: FDD8780; PROD_ID: TRANS-09984
R1 R3-R19 R21 R28 = oresat-rcl:R-US_: RESISTOR, American symbol
R2 = R-Panasonic-EXB-2HV103JV:EXB-2HV103JV; BUILT_BY: EMA_UL_Team; DPN: Y1103CT-ND; MPN: EXB-2HV103JV; SOURCELIBRARY: Update_to_database_2020-12-03; VENDOR: Panasonic
R20 = R-Panasonic-EXB_A10PXXXJ:EXB-A10P391J; DPN: U7103CT-ND; MFR: Panasonic Electronic Components; MPN: EXB-A10P103J; MPN_GENERIC: EXB-A10PXXXJ
R22-R27 R29 R30 = oresat-rcl:R-US_: RESISTOR, American symbol; DIS: Dgi-Key; DPN: 311-100MCT-ND; MFR: Yageo; MPN: RC0201FR-07100RL
REFCLK THERM+ THERM- TP1-TP38 = oresat-misc:TEST-POINT-LARGE-SQUARE
TP39-TP46 = oresat-misc:TEST-POINT-SMD-0.5MM: TEST PAD 0.5mm
U1-U5 = U-Analog-LT3042-ultralow-noise-ldo:LT3042IMSE#TRPBF: Ldo, Adj, 0.2a, 0v-15v, Msop-10; DESCRIPTION: LDO Regulator Pos 0V to 15V 0.2A Automotive Medical 10-Pin MSOP EP T/R; DPN: LT3042IMSE#TRPBFCT-ND; MF: Analog Devices; MPN: LT3042IMSE#TRPBF; PACKAGE: MSOP -10 Analog Devices; PURCHASE-URL: https://pricing.snapeda.com/search/part/LT3042IMSE#TRPBF/?ref=eda
U6 = U-TI-TLC3704:TLC3704IPWR; DATASHEET_URL: http://www.ti.com/lit/gpn/LM2901-Q1; DESCRIPTION: Automotive Catalog Quad Differential Comparator; DPN: 296-18438-1-ND; FAMILY_NAME: COMPARATOR; GENERIC_PART_NUMBER: LM2901-Q1; INDUSTRY_STD_PKG_TYPE: TSSOP; MANUFACTURER: Texas Instruments; MPN: LM2901QPWRQ1; PACKAGE_DESIGNATOR: PW; PIN_COUNT: 14; VENDOR: Texas Instruments
U7 = U-TI-DS90CR218-LVDSReceiver:DS90CR218AMTD/NOPB; DIS: Digi-Key; DPN: DS90CR218AMTD/NOPB-ND; MFR: Texas Instruments; MPN: DS90CR218AMTD/NOPB
U$2 = PocketBeagle:POCKETBEAGLE; DPN: POCKETBEAGLE-SC-569-ND; MPN: POCKETBEAGLE-SC-569
X1 = X-OSCILLATOR-GENERIC:OSC_GENERIC_2.5X2.0

## Net classes
1 diff-pair: width 0.381 mm, clearance 0.508 mm to class 0, clearance 0.254 mm